# Altium schematic sheet Amplifier.SchDoc
size A3; DocumentNumber: 4; SheetNumber: 4; SheetTotal: 9
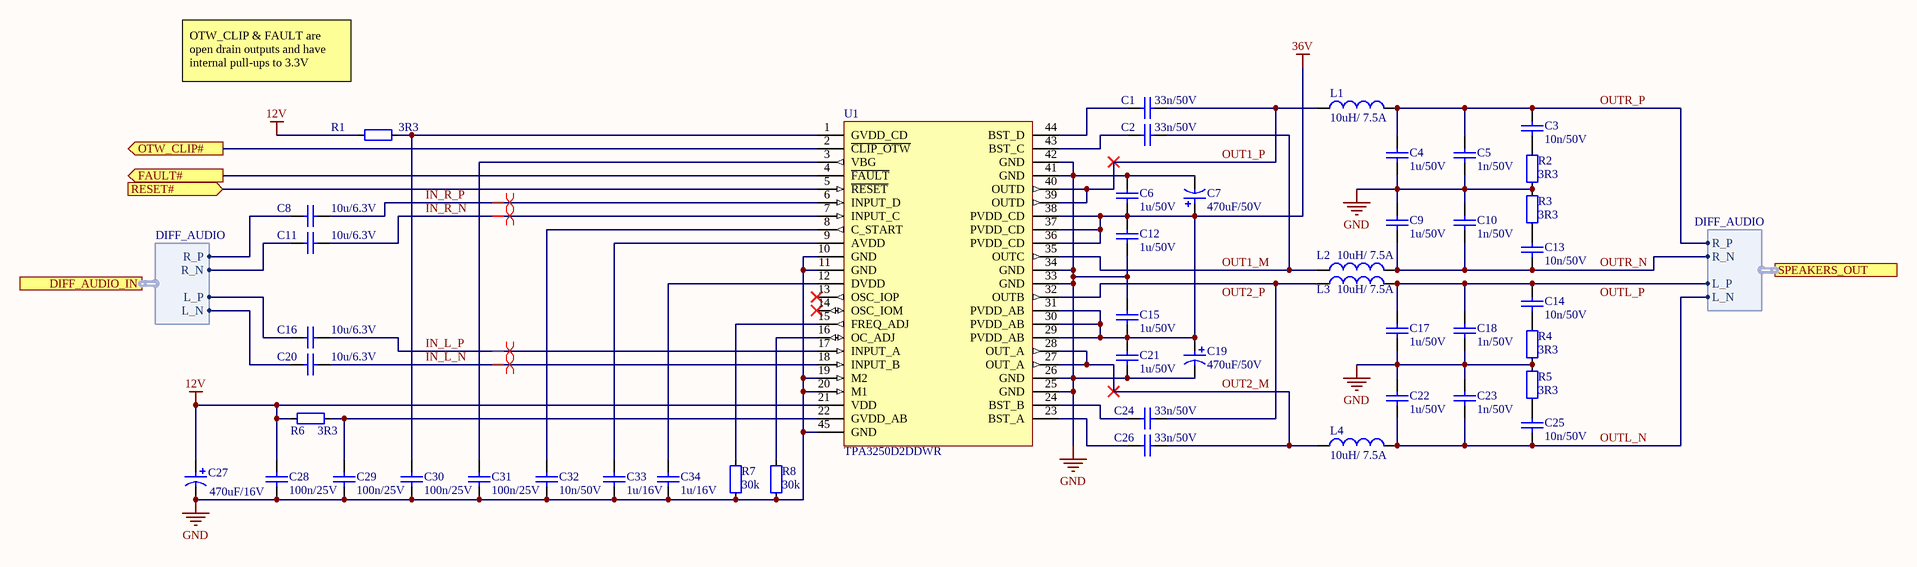
[diagram p0: Amplifier.SchDoc]

## Parts
C1  33n/50V  [C0603]
C2  33n/50V  [C0603]
C3  10n/50V  [C0402]
C4  1u/50V  [C2824]
C5  1n/50V  [C0402]
C6  1u/50V  [C0805]
C7  470uF/50V  [Wurth-L17-D16]
C8  10u/6.3V  [C0805]
C9  1u/50V  [C2824]
C10  1n/50V  [C0402]
C11  10u/6.3V  [C0805]
C12  1u/50V  [C0805]
C13  10n/50V  [C0402]
C14  10n/50V  [C0402]
C15  1u/50V  [C0805]
C16  10u/6.3V  [C0805]
C17  1u/50V  [C2824]
C18  1n/50V  [C0402]
C19  470uF/50V  [Wurth-L17-D16]
C20  10u/6.3V  [C0805]
C21  1u/50V  [C0805]
C22  1u/50V  [C2824]
C23  1n/50V  [C0402]
C24  33n/50V  [C0603]
C25  10n/50V  [C0402]
C26  33n/50V  [C0603]
C27  470uF/16V  [Wurth-L10.5-D8]
C28  100n/25V  [C0402]
C29  100n/25V  [C0402]
C30  100n/25V  [C0402]
C31  100n/25V  [C0402]
C32  10n/50V  [C0402]
C33  1u/16V  [C0603]
C34  1u/16V  [C0603]
L1  10uH/ 7.5A  [PA4342.103NLT]
L2  10uH/ 7.5A  [PA4342.103NLT]
L3  10uH/ 7.5A  [PA4342.103NLT]
L4  10uH/ 7.5A  [PA4342.103NLT]
R1  3R3  [R0402]
R2  3R3  [R0402]
R3  3R3  [R0402]
R4  3R3  [R0402]
R5  3R3  [R0402]
R6  3R3  [R0402]
R7  30k  [R0402]
R8  30k  [R0402]
U1  TPA3250D2DDWR  [HTSSOP-44]

## Ports
DIFF_AUDIO_IN (harness DIFF_AUDIO), FAULT# (out), OTW_CLIP# (out), RESET# (in), SPEAKERS_OUT (harness DIFF_AUDIO)

## Harnesses
DIFF_AUDIO: L_N, L_P, R_N, R_P

## Nets
12V: C27.1 C28.2 R1.2 R6.2 U1.21(VDD)
36V: C6.1 C7.1 C12.2 C15.1 C19.1 C21.2 U1.29(PVDD_AB) U1.30(PVDD_AB) U1.31(PVDD_AB) U1.36(PVDD_CD) U1.37(PVDD_CD) U1.38(PVDD_CD)
GND: C4.1 C5.1 C6.2 C7.2 C9.2 C10.2 C12.1 C15.2 C17.1 C18.1 C19.2 C21.1 C22.2 C23.2 C27.2 C28.1 C29.1 C30.1 C31.1 C32.1 C33.1 C34.1 R2.1 R3.2 R4.1 R5.2 R7.1 R8.1 U1.10(GND) U1.11(GND) U1.19(M2) U1.20(M1) U1.25(GND) U1.26(GND) U1.33(GND) U1.34(GND) U1.41(GND) U1.42(GND) U1.45(GND)
FAULT#: U1.4(~{FAULT}) ; port FAULT#
IN_L_N: C20.2 U1.18(INPUT_B)
IN_L_P: C16.2 U1.17(INPUT_A)
IN_R_N: C11.2 U1.7(INPUT_C)
IN_R_P: C8.2 U1.6(INPUT_D)
OTW_CLIP#: U1.2(~{CLIP_OTW}) ; port OTW_CLIP#
OUT1_M: C2.2 L2.1 U1.35(OUTC)
OUT1_P: C1.2 L1.1 U1.39(OUTD) U1.40(OUTD)
OUT2_M: C26.2 L4.1 U1.27(OUT_A) U1.28(OUT_A)
OUT2_P: C24.2 L3.1 U1.32(OUTB)
OUTL_N: C22.1 C23.1 C25.1 L4.2 ; port SPEAKERS_OUT.L_N
OUTL_P: C14.2 C17.2 C18.2 L3.2 ; port SPEAKERS_OUT.L_P
OUTR_N: C9.1 C10.1 C13.1 L2.2 ; port SPEAKERS_OUT.R_N
OUTR_P: C3.2 C4.2 C5.2 L1.2 ; port SPEAKERS_OUT.R_P
RESET#: U1.5(~{RESET}) ; port RESET#
NetC1_1: C1.1 U1.44(BST_D)
NetC2_1: C2.1 U1.43(BST_C)
NetC3_1: C3.1 R2.2
NetC8_1: C8.1 ; port DIFF_AUDIO_IN.R_P
NetC11_1: C11.1 ; port DIFF_AUDIO_IN.R_N
NetC13_2: C13.2 R3.1
NetC14_1: C14.1 R4.2
NetC16_1: C16.1 ; port DIFF_AUDIO_IN.L_P
NetC20_1: C20.1 ; port DIFF_AUDIO_IN.L_N
NetC24_1: C24.1 U1.24(BST_B)
NetC25_2: C25.2 R5.1
NetC26_1: C26.1 U1.23(BST_A)
NetC29_2: C29.2 R6.1 U1.22(GVDD_AB)
NetC30_2: C30.2 R1.1 U1.1(GVDD_CD)
NetC31_2: C31.2 U1.3(VBG)
NetC32_2: C32.2 U1.8(C_START)
NetC33_2: C33.2 U1.9(AVDD)
NetC34_2: C34.2 U1.12(DVDD)
NetR7_2: R7.2 U1.15(FREQ_ADJ)
NetR8_2: R8.2 U1.16(OC_ADJ)

Not connected (* = marked no-connect by the designer): U1 13(OSC_IOP)* 14(OSC_IOM)*

## Layout directives
differential pair: IN_L_N, IN_L_P, IN_R_N, IN_R_P

## Notes on the sheet
- OTW_CLIP & FAULT are open drain outputs and have internal pull-ups to 3.3V
- Title
- Date:
- Number:
- Revision:
- Sheet
- of
- File:
- Author

## Library data of the parts
C1 C2 C24 C26 = 33n 50V X7R 0603: Manufacturer Part Number 1: 885012206092; Manufacturer 1: Wurth Elektronik; Voltage: 50V; Tolerance: 10%; Specifications: X7R 33n 50V ±10%; Capacitance: 33n; Dielectric: X7R; Supplier 1: Mouser; Supplier Part Number 1: 710-885012206092
C3 C13 C14 C25 C32 = 10n 50V X7R 0402: Manufacturer Part Number 1: 885012205067; Manufacturer 1: Wurth Elektronik; Voltage: 50V; Tolerance: 10%; Specifications: X7R 10n 50V ±10%; Capacitance: 10n; Dielectric: X7R; Supplier 1: Mouser; Supplier Part Number 1: 710-885012205067
C4 C9 C17 C22 = 1u 50V PET 2824: Manufacturer Part Number 1: CB052D0105JBC; Manufacturer 1: AVX; Voltage: 50V; Tolerance: 5%; Specifications: PET 1u 50V ±5%; Capacitance: 1u; Dielectric: PET; Supplier 1: Mouser; Supplier Part Number 1: 581-CB052D0105J
C5 C10 C18 C23 = 1n 50V X7R 0402: Manufacturer Part Number 1: 885012205061; Manufacturer 1: Wurth Elektronik; Voltage: 50V; Tolerance: 10%; Specifications: X7R 1n 50V ±10%; Capacitance: 1n; Dielectric: X7R; Supplier 1: Mouser; Supplier Part Number 1: 710-885012205061
C6 C12 C15 C21 = 1u 50V X7R 0805: Manufacturer Part Number 1: 08055C105K4T2A; Manufacturer 1: AVX; Voltage: 50V; Tolerance: 10%; Specifications: X7R 1u 50V ±10%; Capacitance: 1u; Dielectric: X7R; Supplier 1: Mouser; Supplier Part Number 1: 581-08055C105K4T2A
C7 C19 = Wurth-470uF-50V-L17-D16: Aluminium Electrolytic Capacitors - SMD WCAP-ASLL 50V 470uF 20% ESR=73mOhms; Manufacturer Part Number 1: 865060663013; Manufacturer 1: Wurth Elektronik; Specifications: 470uF 50V ±20%; ComponentLink1Description: Datasheet; ComponentLink1URL: https://www.mouser.co.uk/datasheet/2/445/865080253012-1075191.pdf; Capacitance: 470uF; Voltage: 50V; Tolerance: 20%; Supplier 1: Mouser; Supplier Part Number 1: 710-865060663013
C8 C11 C16 C20 = 10u 6V3 X7R 0805: Manufacturer Part Number 1: JMK212B7106KG-T; Manufacturer 1: Taiyo Yuden; Voltage: 6.3V; Tolerance: 10%; Specifications: X7R 10u 6.3V ±10%; Capacitance: 10u; Dielectric: X7R; Supplier 1: Mouser; Supplier Part Number 1: 963-JMK212B7106KG-T
C27 = Wurth-470uF-16V-L10.5-D8: Aluminium Electrolytic Capacitors - SMD WCAP-ASLI 470uF 16V 20% SMD/SMT; Manufacturer Part Number 1: 865080353015; Manufacturer 1: Wurth Elektronik; ComponentLink1Description: Datasheet; ComponentLink1URL: https://www.mouser.co.uk/datasheet/2/445/865080353015-1726381.pdf; Capacitance: 470uF; Voltage: 16V; Tolerance: 20%; Specifications: 470uF 16V ±20%; Supplier 1: Mouser; Supplier Part Number 1: 710-865080353015
C28-C31 = 100n 25V X7R 0402: Manufacturer Part Number 1: MC0402B104K250CT; Manufacturer 1: MULTICOMP PRO; Voltage: 25V; Tolerance: 10%; Specifications: X7R 100n 25V ±10%; Capacitance: 100n; Dielectric: X7R; Supplier 1: Farnell; Supplier Part Number 1: 2320759
C33 C34 = 1u 16V X7R 0603: Manufacturer Part Number 1: 885012206052; Manufacturer 1: Wurth Elektronik; Voltage: 16V; Tolerance: 10%; Specifications: X7R 1u 16V ±10%; Capacitance: 1u; Dielectric: X7R; Supplier 1: Mouser; Supplier Part Number 1: 710-885012206052
L1-L4 = PA4342.103NLT: Fixed Inductors 10uH 7.5A 4mm 20% Low Prof; Specifications: 10uH 7.5A 20%; ComponentLink1Description: Datasheet; ComponentLink1URL: https://www.mouser.co.uk/datasheet/2/336/P769-1526786.pdf; Inductance: 10uH; Tolerance: 20%; Current: 7.5A; Manufacturer Part Number: PA4342.103NLT; Supplier 1: Mouser; Supplier Part Number 1: 673-PA4342.103NLT
R1-R6 = 3R3 100mW 50V 0402: Manufacturer Part Number 1: RK73H1ETTP3R30F; Manufacturer 1: KOA Speer; Power Rating: 100mW; Tolerance: 1%; Voltage: 50V; Resistance: 3R3; Specifications: =Resistance+ ' '+"Power Rating "+Voltage+' ±'+Tolerance; Supplier 1: Mouser; Supplier Part Number 1: 660-RK73H1ETTP3R30F
R7 R8 = 30k 63mW 50V 0402: Manufacturer Part Number 1: WR04X3002FTL; Manufacturer 1: WALSIN; Power Rating: 63mW; Tolerance: 1%; Voltage: 50V; Resistance: 30k; Specifications: =Resistance+ ' '+"Power Rating "+Voltage+' ±'+Tolerance; Supplier 1: Farnell; Supplier Part Number 1: 2668211
U1 = TPA3250D2DDWR: TPA3250 70-W Stereo, 130-W peak PurePath™ Ultra-HD Pad Down Class-D Amplifier; Manufacturer 1: Texas Instruments; ComponentLink1Description: Datasheet; ComponentLink1URL: https://www.ti.com/lit/ds/symlink/tpa3250.pdf; Supplier 1: Digi-Key; Supplier Part Number 1: 296-43794-1-ND; Manufacturer Part Number 1: TPA3250D2DDWR